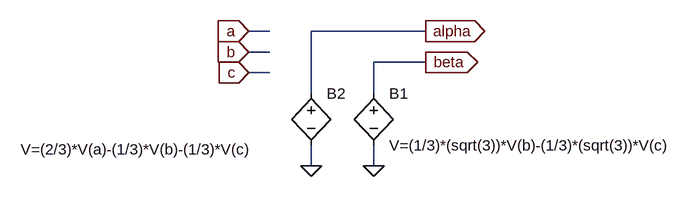
[diagram p0: schematic abc_to_alphabeta.asc]
abc_to_alphabeta.asc, the LTspice schematic file:
Version 4
SHEET 1 880 680
WIRE 32 96 0 96
WIRE 272 96 96 96
WIRE 32 128 0 128
WIRE 272 144 192 144
WIRE 32 160 0 160
WIRE 96 192 96 96
WIRE 192 192 192 144
WIRE 96 304 96 272
WIRE 192 304 192 272
FLAG 0 96 a
IOPIN 0 96 In
FLAG 0 128 b
IOPIN 0 128 In
FLAG 0 160 c
IOPIN 0 160 In
FLAG 272 96 alpha
IOPIN 272 96 Out
FLAG 272 144 beta
IOPIN 272 144 Out
FLAG 96 304 0
FLAG 192 304 0
SYMBOL bv 192 176 R0
SYMATTR InstName B1
SYMATTR Value V=(1/3)*(sqrt(3))*V(b)-(1/3)*(sqrt(3))*V(c)
SYMBOL bv 96 176 R0
WINDOW 3 -447 102 Left 2
SYMATTR InstName B2
SYMATTR Value V=(2/3)*V(a)-(1/3)*V(b)-(1/3)*V(c)

The netlist it stands for:
* abc_to_alphabeta.asc
B1 beta 0 V=(1/3)*(sqrt(3))*V(b)-(1/3)*(sqrt(3))*V(c)
B2 alpha 0 V=(2/3)*V(a)-(1/3)*V(b)-(1/3)*V(c)
.backanno
.end